# EAGLE design khanh_PB_ip5306_1.1 (EAGLE 6.6.0)
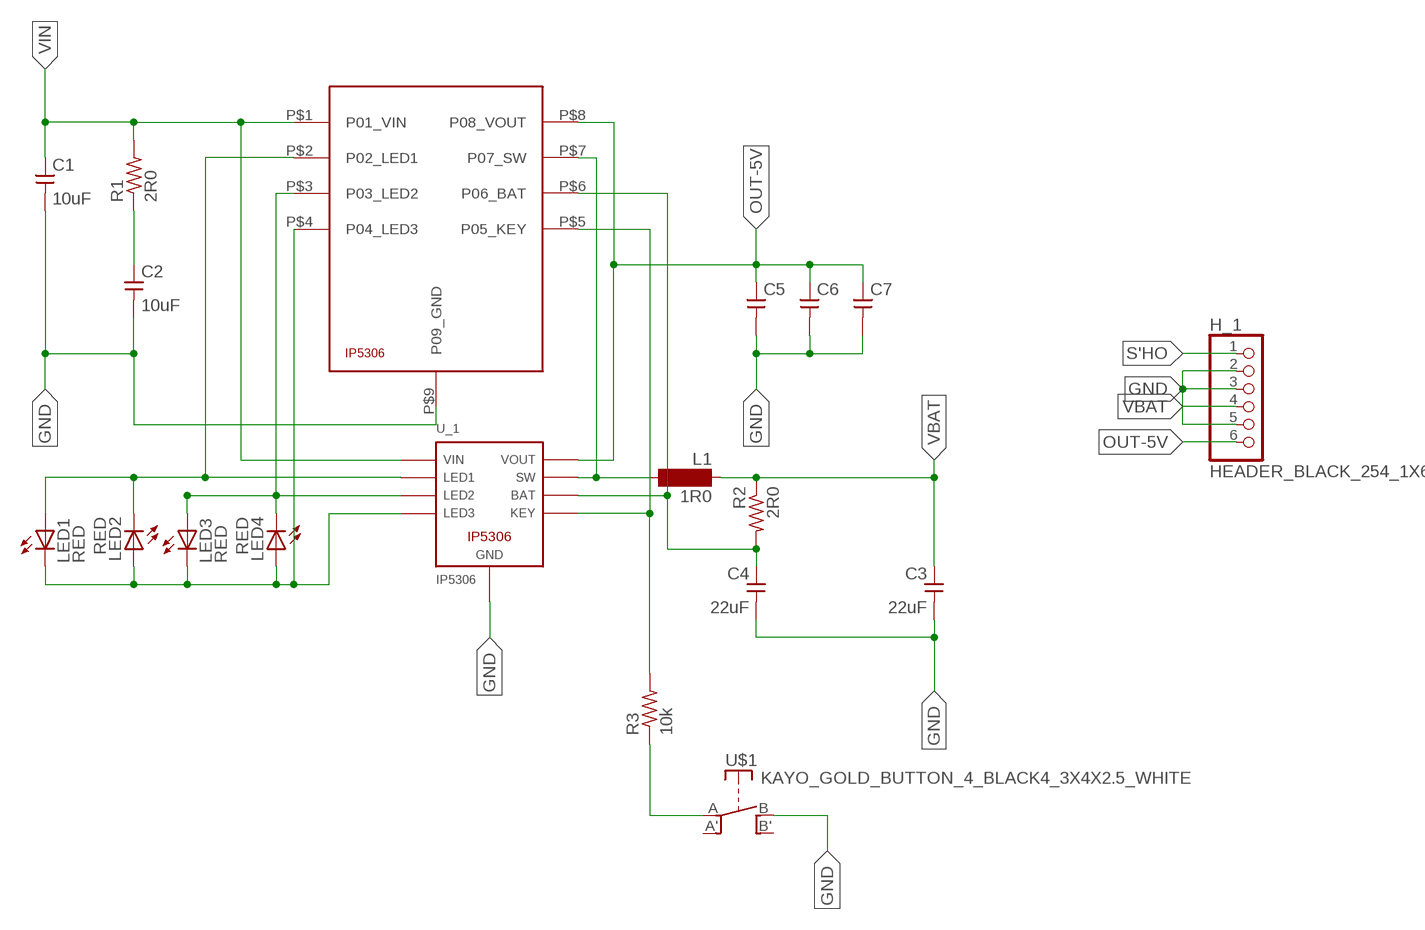
[diagram p0: schematic, sheet 1]

## Parts
C1  10uF  KAYO_CAP_CERAMIC10UF_1206  [C1206]
C2  10uF  KAYO_CAP_CERAMIC10UF_1206  [C1206]
C3  22uF  KAYO_CAP_CERAMIC22UF_1206  [C1206]
C4  22uF  KAYO_CAP_CERAMIC22UF_1206  [C1206]
C5  KAYO_CAP_CERAMIC22UF_KXN_0603  [KXN_C0603]
C6  KAYO_CAP_CERAMIC22UF_KXN_0603  [KXN_C0603]
C7  KAYO_CAP_CERAMIC22UF_KXN_0603  [KXN_C0603]
H_1  HEADER_BLACK_254_1X6  KXN_HEADER_1X6  [HEADER_1X6_254]
L1  1R0  INDUCTOR_FEEDER_KAYO_0650  [CKST_0603_0630_PACK]
LED1  RED  KAYO_LED_RED_KXN_LED_0603  [KXN_LED_0603]
LED2  RED  KAYO_LED_RED_KXN_LED_0603  [KXN_LED_0603]
LED3  RED  KAYO_LED_RED_KXN_LED_0603  [KXN_LED_0603]
LED4  RED  KAYO_LED_RED_KXN_LED_0603  [KXN_LED_0603]
R1  2R0  R-US_R0603  [R0603]
R2  2R0  R-US_R0603  [R0603]
R3  10k  R-US_R0603  [R0603]
U$1  KAYO_GOLD_BUTTON_4_BLACK4_3X4X2.5_WHITE  [KXN_BUTTON_3_4_2.5MM]
U$2  IP5306  [IP5306]
U_1  IP5306  IP5306_1  [ESOP8]

## Nets
BAT: C4.1(+) R2.2 U$2.P$6(P06_BAT) U_1.6
GND: C1.2(-) C2.2(-) C3.2(-) C4.2(-) C5.2(-) C6.2(-) C7.2(-) H_1.2 H_1.3 H_1.5 U$1.B U$2.P$9(P09_GND) U_1.9
N$1: C2.1(+) R1.1
N$2: R3.1 U$1.A
N$4: L1.P$2 U$2.P$7(P07_SW) U_1.7
N$5: R3.2 U$2.P$5(P05_KEY) U_1.5
N$6: LED1.A LED2.C U$2.P$2(P02_LED1) U_1.2
N$7: LED1.C LED2.A LED3.C LED4.A U$2.P$4(P04_LED3) U_1.4
N$8: LED3.A LED4.C U$2.P$3(P03_LED2) U_1.3
OUT-5V: C5.1(+) C6.1(+) C7.1(+) H_1.6 U$2.P$8(P08_VOUT) U_1.8
S'HO: H_1.1
VBAT: C3.1(+) H_1.4 L1.P$1 R2.1
VIN: C1.1(+) R1.2 U$2.P$1(P01_VIN) U_1.1
Unconnected: U$1.A' U$1.B'

## Library data of the parts
C1 C2 = kxnStandard_capacitor:KAYO_CAP_CERAMIC; CC_SHOP: CongCo; INFO: C1206 10uF 25V
C3 C4 = kxnStandard_capacitor:KAYO_CAP_CERAMIC; CC_SHOP: CongCo; INFO: C1206 22uF 25V
C5-C7 = kxnStandard_capacitor:KAYO_CAP_CERAMIC; CC_SHOP: CongCo; INFO: C0603 22uF 10V
H_1 = kxnStandard_connector:KXN_HEADER_1X6; CC_SHOP: CongCo
L1 = kxnStandard_inductor:INDUCTOR_FEEDER_KAYO: INDUCTOR SMD power inductor size: 4.6 x 4.1 x 2 (mm) https://item.taobao.com/item.htm?spm=a1z10.3-c-s.w4002-21223910208.37.43076a4bKJhobU&id=528437837997
LED1-LED4 = kxnStandard_led:KAYO_LED: LED OSRAM: - CHIPLED LG R971, LG N971, LY N971, LG Q971, LY Q971, LO R971, LY R971 LH N974, LH R974 LS Q976, LO Q976, LY Q976 LO Q996 - Hyper CHIPLED LW Q18S LB Q993, LB Q99A, LB R99A - SideLED LS A670, LO A670, LY A670, LG A670, LP A670 LB A673, LV A673, LT A673, LW A673 LH A674 LY A675 LS A676, LA A676, LO A676, LY A676, LW A676 LS A679, LY A679, LG A679 - Hyper Micro SIDELED® LS Y876, LA Y876, LO Y876, LY Y876 LT Y87S - SmartLED LW L88C, LW L88S LB L89C, LB L89S, LG L890 LS L89K, LO L89K, LY L89K LS L896, LA L896, LO L896, LY L896 - TOPLED LS T670, LO T670, LY T670, LG T670, LP T670 LSG T670, LSP T670, LSY T670, LOP T670, LYG T670 LG T671, LOG T671, LSG T671 LB T673, LV T673, LT T673, LW T673 LH T674 LS T676, LA T676, LO T676, LY T676, LB T676, LH T676, LSB T676, LW T676 LB T67C, LV T67C, LT T67C, LS T67K, LO T67K, LY T67K, LW E67C LS E67B, LA E67B, LO E67B, LY E67B, LB E67C, LV E67C, LT E67C LW T67C LS T679, LY T679, LG T679 LS T770, LO T770, LY T770, LG T770, LP T770 LB T773, LV T773, LT T773, LW T773 LH T774 LS E675, LA E675, LY E675, LS T675 LS T776, LA T776, LO T776, LY T776, LB T776 LHGB T686 LT T68C, LB T68C - Hyper Mini TOPLED® LB M676 - Mini TOPLED Santana® LG M470 LS M47K, LO M47K, LY M47K Source: http://www.osram.convergy.de/; CC_COST: 0.025; CC_ID: 522554271548; CC_LINK: https://item.taobao.com/item.htm?id=522554271548&skuId=5766142345185; CC_OPTION: 0603_红色(20只); CC_SHOP: CongCo; INFO: Led 0603 RED; JLC_PART_COST: 0.0056; JLC_PART_ID: C2286; JLC_PART_LINK: https://jlcpcb.com/partdetail/Hubei_KentoElec-KT0603R/C2286; KXN_ID: SA12131249
R1-R3 = kxnStandard_resistor:R-US_: RESISTOR, American symbol; CC_SHOP: CongCo
U$1 = kxn_Standard_button_switch:KAYO_GOLD_BUTTON_4*4: Button size: 4*4*1.5 or 4*4*3 item.htm?id=557115198331 https://jlcpcb.com/partdetail/Alpsalpine-SKRPABE010/C115360 Button_3x4x2.5mm_SKRPABE010_datasheet.pdf; INFO: BUTTON 4P SMD 3*4*2.5
U$2 = khanh_ic_function:IP5306
U_1 = kxnStandard_IC_Function:IP5306; CC_SHOP: CongCo

## Board
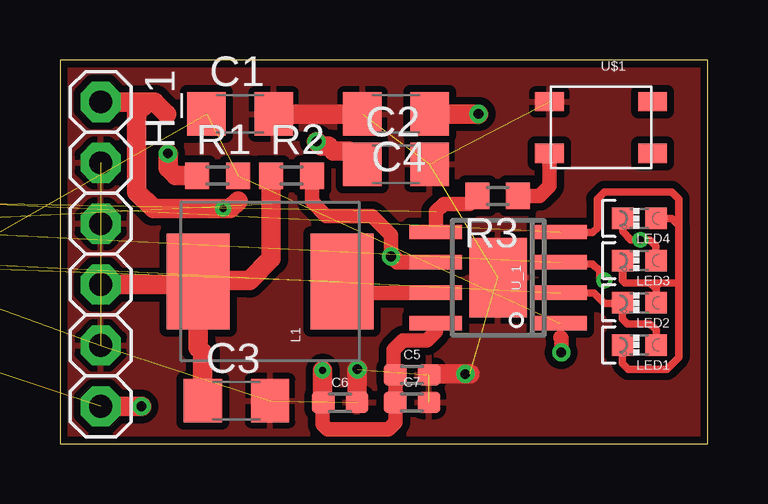
[diagram p1: board, top side]
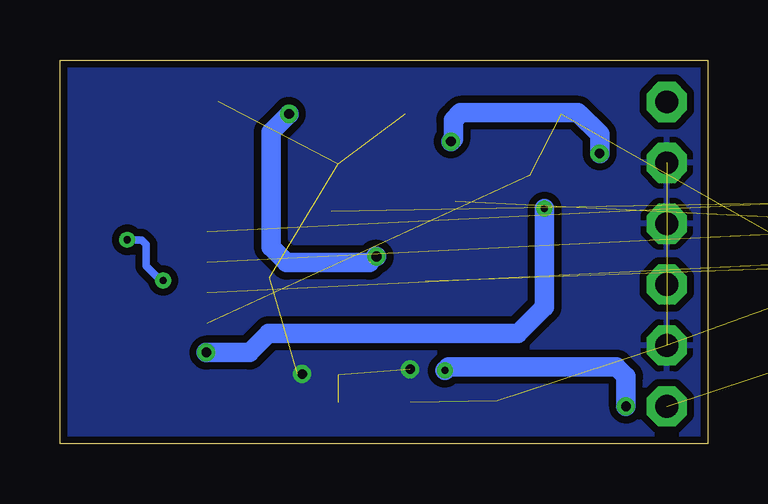
[diagram p2: board, bottom side, seen from below]

Size 27 x 16 mm. Coordinates in mm from the lower left corner, seen from the top.
Outline: 0,0 27,0 27,16 0,16 0,0
Copper layers (1*16): Top 0.035mm / dielectric 1.5mm / Bottom 0.035mm
Design rules "SparkFun-2-Layer-General-JLCPCB_kxnUsing": minimum track width 7mil, minimum drill 0.3mm, track to track 7mil, track to pad 7mil, pad to pad 7mil, via to via 7mil, smd to smd 7mil, copper to edge 7mil, drill to drill 7mil, minimum pad ring 7mil, minimum via ring 7mil, stop-mask expansion 0mil, vias tented up to drill 0.3mm, thermal gap 10mil

### Footprints (pad centres in the part's own frame; a part is rotated, then mirrored left to right if it is on the bottom)
C1206 = smd 1.6 x 1.8: 1 -1.4,0; 2 1.4,0
KXN_C0603 = smd 0.95 x 0.9: 1 -0.7,0; 2 0.7,0
HEADER_1X6_254 = drill 0.95 pad 1.676 octagon: 1 -6.35,0; 2 -3.81,0; 3 -1.27,0; 4 1.27,0; 5 3.81,0; 6 6.35,0
CKST_0603_0630_PACK = smd 2.63 x 4: P$1 -3,0; P$2 3,0
KXN_LED_0603 = smd 0.9 x 0.9: A 0.7,0; C -0.7,0
R0603 = smd 1 x 1.1: 1 -0.85,0; 2 0.85,0
KXN_BUTTON_3_4_2.5MM = smd 1.2 x 0.8: A -2.15,-1.075; A' 2.15,-1.075; B -2.15,1.075; B' 2.15,1.075
IP5306 = smd 0.55 x 1.2: P$1 -1.905,-3.075; P$2 -0.635,-3.075; P$3 0.635,-3.075; P$4 1.905,-3.075; P$5 1.905,3.075; P$6 0.635,3.075; P$7 -0.635,3.075; P$8 -1.905,3.075 | smd 3.3 x 2.4: P$9 0,0
ESOP8 = smd 0.6 x 2.2: 1 -1.905,-2.6; 2 -0.635,-2.6; 3 0.635,-2.6; 4 1.905,-2.6; 5 1.905,2.6; 6 0.635,2.6; 7 -0.635,2.6; 8 -1.905,2.6 | smd 3.3 x 2.4: 9 0,0

### Placement (x,y rotation side)
C1  7.51,13.75 0 top
C2  14.01,11.65 0 top
C3  7.36,1.79 0 top
C4  14.01,13.75 180 top
C5  14.68,2.87 0 top
C6  11.68,1.71 0 top
C7  14.68,1.72 0 top
H_1  1.7,7.9 270 top
L1  8.76,6.76 0 top
LED1  24.16,4.11 0 top
LED2  24.16,5.87 0 top
LED3  24.16,7.63 0 top
LED4  24.16,9.39 0 top
R1  6.57,11.17 0 top
R2  9.66,11.17 0 top
R3  18.25,10.33 180 top
U$1  22.56,13.18 0 top
U$2  -9.9,8.3 90 top  (outside the outline)
U_1  18.27,6.92 90 top

### Tracks (layer width: path | path; a pad name or v marks a point on that pad's centre or on a via)
BAT  (via drill 0.4 pad 0.7)  (2 unrouted)
  Top 0.61: R2.2 10.51,10.09 11.1,9.5 13,9.5 13.8,8.7 13.8,7.85 13.85,7.8 13.95,7.8 14.2,7.55 | 14.2,7.55 U_1.6 | 14.2,7.55 14.05,7.55 v13.8,7.8
  Top 0.813: v17.45,13.75 C4.1
  Bottom 0.813: 14.1,7.55 17.55,7.55 18.2,8.2 18.2,13 v17.45,13.75 | v13.8,7.8 13.85,7.8
GND  (via drill 0.4 pad 0.7)  (11 unrouted)
  Top 0.813: C1.2 C4.2 | C6.2 12.38,3.08 v12.4,3.1 | 17.1,2.9 v16.9,2.9 15.41,2.9 C5.2
  pour Top (isolate 0.305, rank 6): 0,0 27,0 27,16 0,16
  pour Bottom (isolate 0.305, rank 6): 0,0 27,0 27,16 0,16
N$1  (via drill 0.4 pad 0.7)
  Top 0.813: R1.1 4.83,11.17 4.5,11.5 v4.5,12.1 | v10.7,12.6 10.9,12.4 11.2,12.4 11.4,12.2 12.06,12.2 C2.1
  Bottom 0.813: v4.5,12.1 4.5,12.9 5.4,13.8 10.3,13.8 10.6,13.5 10.6,12.7 v10.7,12.6
N$2
  Top 0.61: R3.1 19.98,10.33 20.4,10.75 20.4,12.1 U$1.A
N$4  (1 unrouted)
  Top 0.61: U_1.7 12.23,6.29 L1.P$2
N$5  (1 unrouted)
  Top 0.61: U_1.5 15.67,9.67 16,10 17.07,10 R3.2
N$6  (1 unrouted)
  Top 0.305: LED1.A 24.86,4.74 24.6,5 23.65,5 23.45,5.2 LED2.C 23.44,5.85 22.7,5.85 22.27,6.29 U_1.2
N$7  (1 unrouted)
  Top 0.305: 24.6,6.7 24.86,6.44 LED2.A 24.86,6.56 25,6.7 | 24.6,6.7 23.55,6.7 23.45,6.8 | 23.45,6.8 LED3.C 23.46,6.81 23.45,6.8 | LED4.A 25.51,9.39 25.8,9.1 | 25.8,9.1 25.8,6.7 | 25.8,6.7 25.8,3.6 25.3,3.1 23.7,3.1 23.45,3.35 LED1.C | 25,6.7 25.8,6.7 | 24.6,6.7 25,6.7 | 25.8,9.1 25.8,10.2 25.5,10.5 22.7,10.5 22.4,10.2 22.4,9 22.2,8.8 20.89,8.8 U_1.4
N$8  (via drill 0.3 pad 0.6)  (1 unrouted)
  Top 0.305: LED4.C 23.46,8.84 23.8,8.5 v24.2,8.5 24.6,8.5 24.85,8.25 LED3.A | v22.7,6.8 22.6,6.8 22.5,6.9 22.5,7.2 22.2,7.5 20.93,7.5 U_1.3
  Bottom 0.305: v24.2,8.5 23.6,8.5 23.4,8.3 23.4,7.4 22.8,6.8 v22.7,6.8
OUT-5V  (via drill 0.3 pad 0.6, 0.4 pad 0.7)  (1 unrouted)
  Top 0.61: U_1.8 15.67,4.67 15.3,4.3 14.3,4.3 13.9,3.9 13.9,2.95 C5.1 C7.1 13.98,0.88 13.7,0.6 11.15,0.6 10.95,0.8 10.95,1.68 C6.1
  Top 0.813: H_1.6 v3.4,1.55 | v10.95,3.05 10.95,1.74 C6.1
  Bottom 0.813: v3.4,1.55 3.4,2.8 3.8,3.2 10.8,3.2 v10.95,3.05
S'HO  (via drill 0.3 pad 0.6, 0.4 pad 0.7)
  Top 0.61: 20.87,4.43 20.9,4.4 v20.9,3.8
  Top 0.813: H_1.1 3.65,14.25 | 4.45,13.75 3.95,14.25 3.65,14.25 | 3.65,14.25 3.2,13.8 3.2,10.5 3.9,9.8 v6.8,9.8 7.1,9.8 7.42,10.12
  Bottom 0.813: v6.8,9.8 6.8,5.7 7.9,4.6 18.3,4.6 19.1,3.8 v20.9,3.8
VBAT
  Top 0.813: R2.1 8.81,7.71 7.9,6.8 5.8,6.8 L1.P$1 | H_1.4 5.63,6.63 L1.P$1 | L1.P$1 5.76,3.99 5.95,3.8 C3.1
VIN  (3 unrouted)